# Altium schematic sheet Power.SchDoc
size A4 portrait
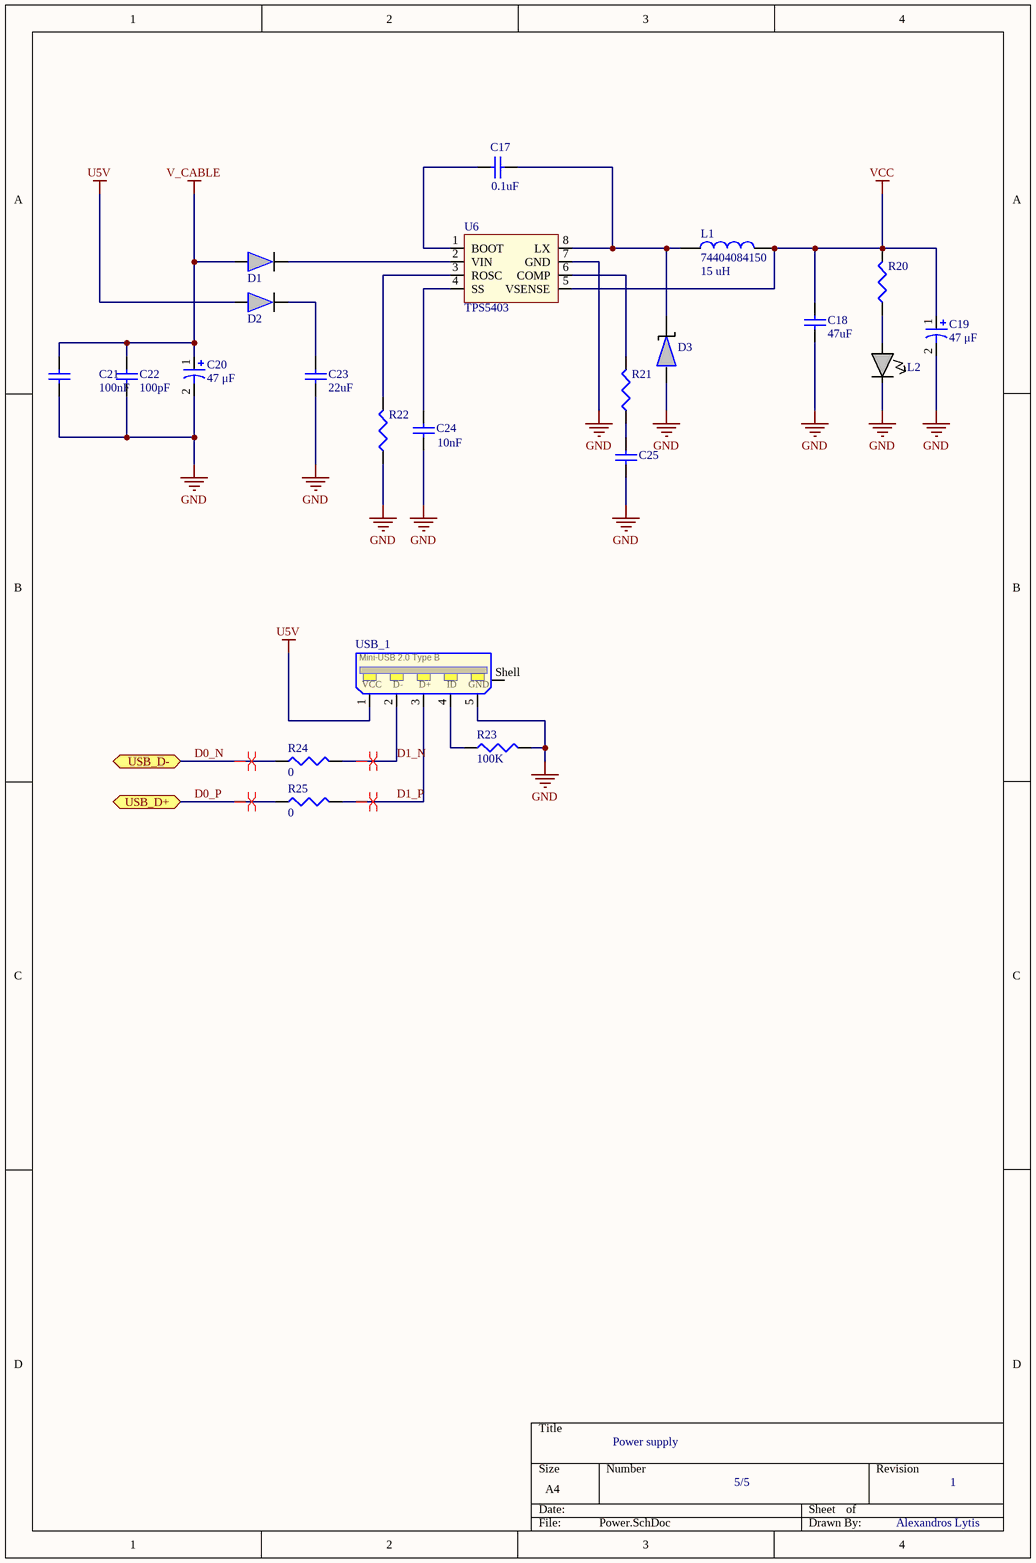
[diagram p0: Power.SchDoc]

## Parts
C17  value 0.1uF  [CAP0603]  (hidden comment: Cap Semi)
C18  value 47uF  [CAP0603]  (hidden comment: Cap Semi)
C19  47 μF  [WCAP-PSLP 6.3x5.8x2.2]
C20  47 μF  [WCAP-PSLP 6.3x5.8x2.2]
C21  value 100nF  [CAP0603]  (hidden comment: Cap Semi)
C22  value 100pF  [CAP0603]  (hidden comment: Cap Semi)
C23  value 22uF  [CAP0603]  (hidden comment: Cap Semi)
C24  value 10nF  [CAP0603]  (hidden comment: Cap Semi)
C25  Cap Semi  [CAP0603]  (value not drawn)
D1  MBR180S1 schottky  [MBR180S1]  (value not drawn)
D2  MBR180S1 schottky  [MBR180S1]  (value not drawn)
D3  schottky Diode  [DIOM1709X08N]  (value not drawn)
L1  74404084150  value 15 uH  [WE-LQS_8040]
L2  LED_1.6x0.8mm  [J1-0603]  (value not drawn)
R20  Res3  [RES0603]  (value not drawn)
R21  Res3  [RES0603]  (value not drawn)
R22  Res3  [RES0603]  (value not drawn)
R23  value 100K  [RES0603]  (hidden comment: Res3)
R24  value 0  [RES0603]  (hidden comment: Res3)
R25  value 0  [RES0603]  (hidden comment: Res3)
U6  TPS5403  [SOIC127P600X175-8M]
USB_1  65100516121  [65100516121]  (value not drawn)

## Ports
USB_D+, USB_D-

## Nets
GND: C18.1 C19.2 C20.2 C21.1 C22.1 C23.1 C24.1 C25.1 D3.2(anode) L2.2 R22.1 R23.2 U6.7(GND) USB_1.5(GND)
U5V: D2.2(Anode) USB_1.1(VCC)
V_CABLE: C20.1 C21.2 C22.2 D1.2(Anode)
VCC: C18.2 C19.1 L1.2 R20.2 U6.5(VSENSE)
D0_N: R24.1 ; port USB_D-
D0_P: R25.1 ; port USB_D+
D1_N: R24.2 USB_1.2(D-)
D1_P: R25.2 USB_1.3(D+)
NetC17_1: C17.1 D3.1(Cathode) L1.1 U6.8(LX)
NetC17_2: C17.2 U6.1(BOOT)
NetC23_2: C23.2 D2.1(Cathode)
NetC24_2: C24.2 U6.4(SS)
NetC25_2: C25.2 R21.1
NetD1_1: D1.1(Cathode) U6.2(VIN)
NetL2_1: L2.1 R20.1
NetR21_2: R21.2 U6.6(COMP)
NetR22_2: R22.2 U6.3(ROSC)
NetR23_1: R23.1 USB_1.4(ID)

Not connected (* = marked no-connect by the designer): USB_1 Shell

## Layout directives
differential pair: D0_N, D0_P, D1_N, D1_P

## Notes on the sheet
- Power supply
- 5/5
- 1
- Alexandros Lytis
- (in symbol 65100516121) Mini-USB 2.0 Type B

## Library data of the parts
C17 C18 C21-C24 = Cap Semi: Capacitor (Semiconductor SIM Model); Published: 8-Jun-2000; LatestRevisionDate: 29-May-2009; LatestRevisionNote: IPC-7351 Footprint Added.; PackageReference: C1206; Publisher: Altium Limited; PackageDescription: Chip Capacitor
C19 C20 = WCAP-PSLP 6.3x5.8x2.2 875105344006: WCAP-PSLP Aluminum Polymer Capacitors , 47 μF; + / - 20%; 16 V , 6,3 x 5,8; Manufacturer: Wurth Elektronik; E-mail: libraries@we-online.com; Characteristics: Aluminum Polymer Capacitors;Recommended soldering: Reflow;Operating temperature: –55 °C to +105 °C;Low profile SMD product series;Low ESR at high frequency range;High permissible ripple current;Load life: 2000 h @ +105 °C; ComponentLink1Description: Manufacturer; ComponentLink1URL: http://www.we-online.com; ComponentLink2Description: Datasheet; ComponentLink2URL: http://katalog.we-online.de/pbs/datasheet/875105344006.pdf; Created by: Karrer Zheng; Created Date: 5/13/2015; Capacitance: 47 μF; Application: Low voltage port filtering, appplid to high-end switching power supply, PC(desktop,laptop ),industrial computer, VGA card, server power, charger, TV, digital set-top box,DC-DC power module, game machine etc which consume large current with high speed circuit.; partNo: 875105344006
C25 = Cap Semi: Capacitor (Semiconductor SIM Model); Value: 100pF; Published: 8-Jun-2000; LatestRevisionDate: 29-May-2009; LatestRevisionNote: IPC-7351 Footprint Added.; PackageReference: C1206; Publisher: Altium Limited; PackageDescription: Chip Capacitor
D1 D2 = MRB180S1 schottky
D3 = SMD_schottky_CDBU0130L
L1 = 74404084150: WE-LQS SMD Power Inductor, size 8040, 15 uH; RatedCurrent: 2.6 A; PublishedDate: Nov. 2016; Publisher: Wurth Elektronik; ComponentLink1Description: Manufacturer; ComponentLink1URL: http://www.we-online.de; ComponentLink2Description: Datasheet; ComponentLink2URL: http://katalog.we-online.de/pbs/datasheet/74404084150.pdf; PartNumber: 74404084150; Size: 8040
R20-R22 = Res3: Resistor; Value: 1K; Published: 8-Jun-2000; LatestRevisionDate: 29-May-2009; LatestRevisionNote: IPC-7351 Footprint Added.; PackageReference: J1-0603; Publisher: Altium Limited; PackageDescription: Chip Resistor
R23-R25 = Res3: Resistor; Published: 8-Jun-2000; LatestRevisionDate: 29-May-2009; LatestRevisionNote: IPC-7351 Footprint Added.; PackageReference: J1-0603; Publisher: Altium Limited; PackageDescription: Chip Resistor
U6 = TPS5403: switching power-3.3V
USB_1 = 65100516121: WR-COM Mini USB 2.0 Type B SMT Horizontal 5 Contacts; Published: June 2016; Publisher: Wurth Elektronik; ComponentLink1Description: Manufacturer; ComponentLink1URL: http://www.we-online.de; ComponentLink2Description: Datasheet; ComponentLink2URL: http://katalog.we-online.de/em/datasheet/65100516121.pdf; PartNumber: 65100516121